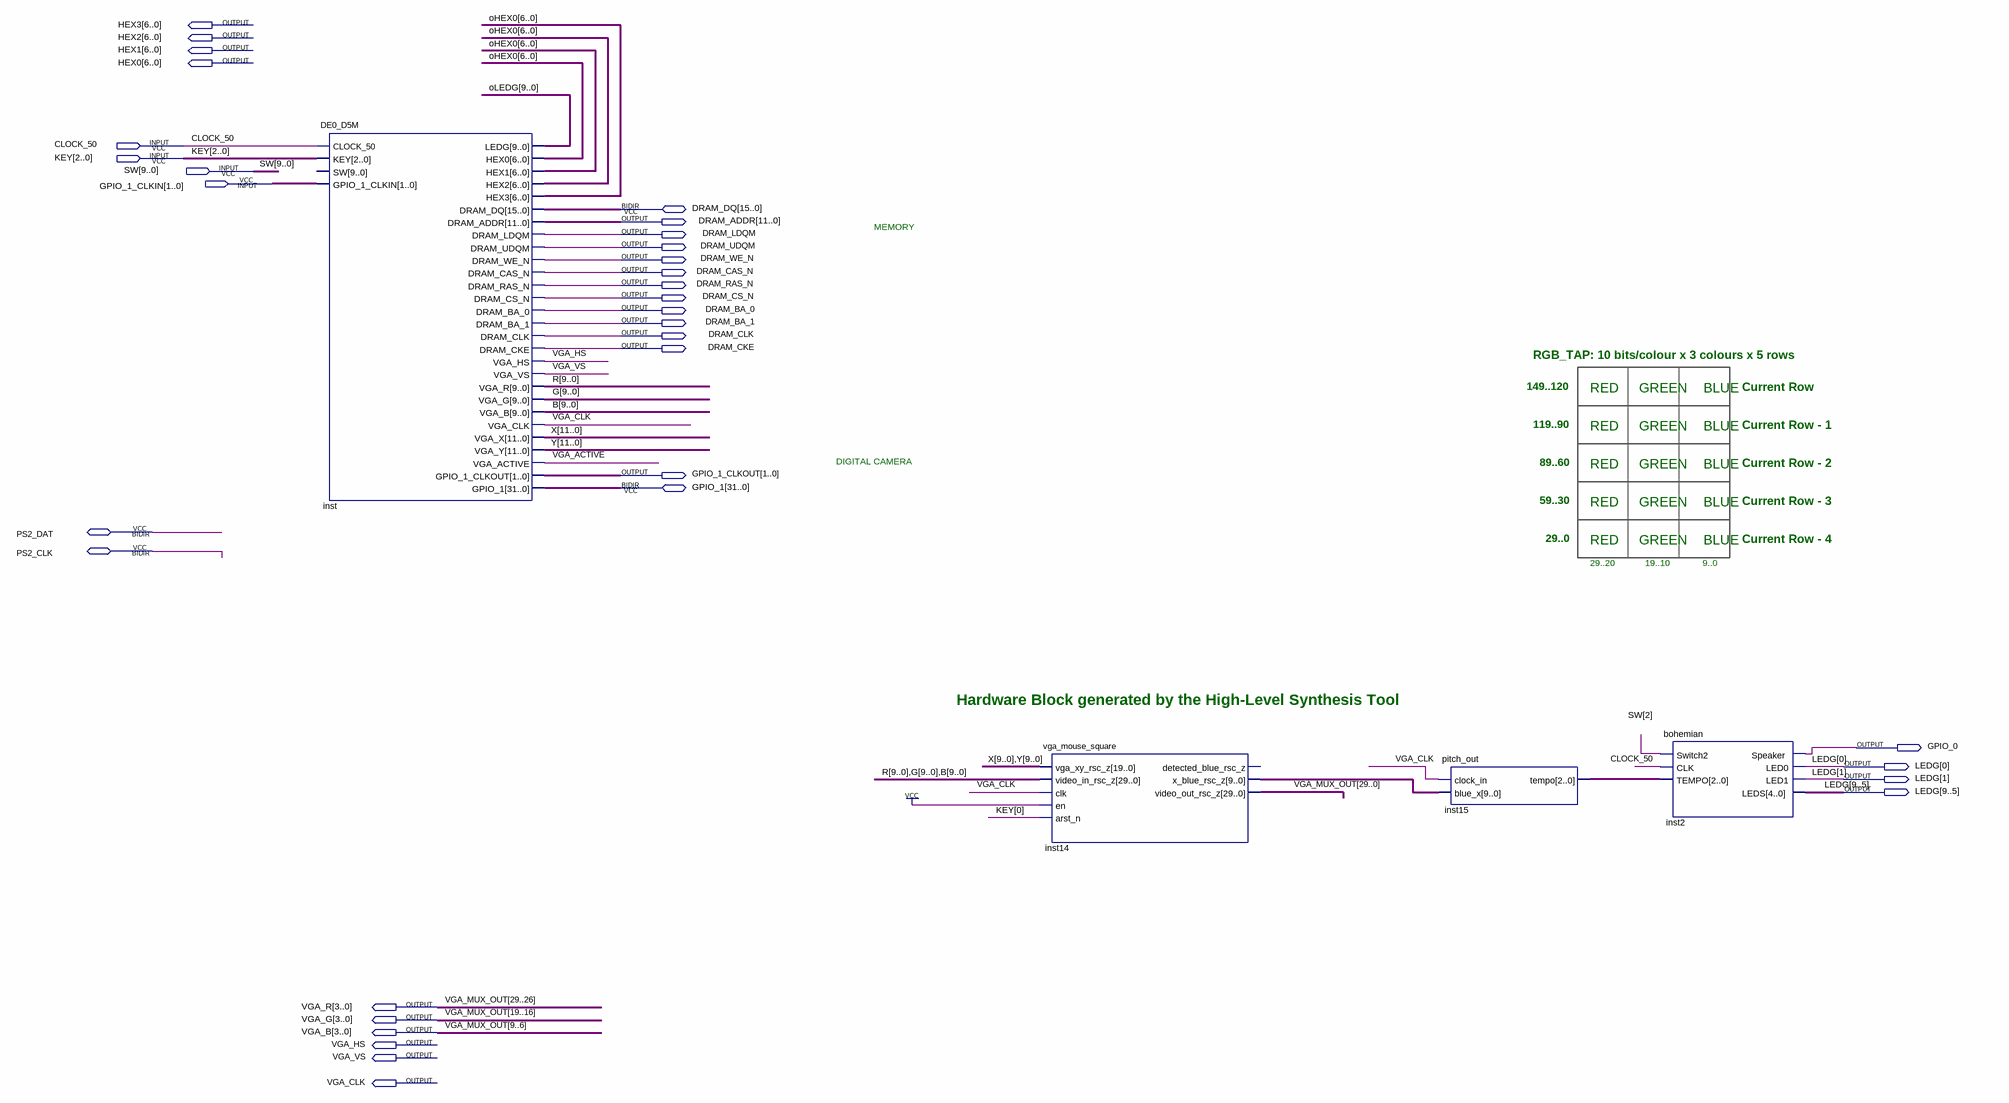
[diagram p0: schematic sheet]
// Quartus schematic TOP_DE0_CAMERA_MOUSE.bdf as structural Verilog: 4 symbols, 34 pins
module TOP_DE0_CAMERA_MOUSE (
  input  CLOCK_50,
  input  [2:0] KEY,
  input  [9:0] SW,
  input  [1:0] GPIO_1_CLKIN,
  inout  [15:0] DRAM_DQ,
  inout  [31:0] GPIO_1,
  inout  PS2_DAT,
  inout  PS2_CLK,
  output [6:0] HEX3,
  output [6:0] HEX2,
  output [6:0] HEX1,
  output [6:0] HEX0,
  output [11:0] DRAM_ADDR,
  output DRAM_LDQM,
  output DRAM_UDQM,
  output DRAM_WE_N,
  output DRAM_CAS_N,
  output DRAM_RAS_N,
  output DRAM_CS_N,
  output DRAM_BA_0,
  output DRAM_BA_1,
  output DRAM_CLK,
  output DRAM_CKE,
  output [1:0] GPIO_1_CLKOUT,
  output GPIO_0,
  output [9:0] LEDG,
  output [3:0] VGA_R,
  output [3:0] VGA_G,
  output [3:0] VGA_B,
  output VGA_HS,
  output VGA_VS,
  output VGA_CLK
);

  wire VGA_ACTIVE;
  wire [2:0] inst15_tempo;
  wire [6:0] oHEX0;
  wire [9:0] B, G, inst14_x_blue_rsc_z, oLEDG, R;
  wire [11:0] X, Y;
  wire [25:0] VGA_MUX_OUT;

  DE0_D5M inst (
    .CLOCK_50(CLOCK_50), .KEY(KEY), .GPIO_1_CLKIN(GPIO_1_CLKIN), .LEDG(oLEDG), .HEX0(oHEX0), .HEX1(oHEX0),
    .HEX2(oHEX0), .HEX3(oHEX0), .DRAM_ADDR(DRAM_ADDR), .DRAM_LDQM(DRAM_LDQM), .DRAM_UDQM(DRAM_UDQM),
    .DRAM_WE_N(DRAM_WE_N), .DRAM_CAS_N(DRAM_CAS_N), .DRAM_RAS_N(DRAM_RAS_N), .DRAM_CS_N(DRAM_CS_N),
    .DRAM_BA_0(DRAM_BA_0), .DRAM_BA_1(DRAM_BA_1), .DRAM_CLK(DRAM_CLK), .DRAM_CKE(DRAM_CKE), .VGA_HS(VGA_HS),
    .VGA_VS(VGA_VS), .VGA_R(R), .VGA_G(G), .VGA_B(B), .VGA_CLK(VGA_CLK), .VGA_X(X), .VGA_Y(Y),
    .VGA_ACTIVE(VGA_ACTIVE), .GPIO_1_CLKOUT(GPIO_1_CLKOUT), .DRAM_DQ(DRAM_DQ), .GPIO_1(GPIO_1));  // open: SW
  vga_mouse_square inst14 (
    .vga_xy_rsc_z({X[9:0], Y[9:0]}), .video_in_rsc_z({R, G, B}), .clk(VGA_CLK), .en(1'b1), .arst_n(KEY[0]),
    .x_blue_rsc_z(inst14_x_blue_rsc_z),
    .video_out_rsc_z({VGA_R, VGA_MUX_OUT[25:20], VGA_G, VGA_MUX_OUT[15:10], VGA_B, VGA_MUX_OUT[5:0]}));  // open: detected_blue_rsc_z
  pitch_out inst15 (.clock_in(VGA_CLK), .blue_x(inst14_x_blue_rsc_z), .tempo(inst15_tempo));
  bohemian inst2 (
    .Switch2(SW[2]), .CLK(CLOCK_50), .TEMPO(inst15_tempo), .Speaker(GPIO_0), .LED0(LEDG[0]), .LED1(LEDG[1]),
    .LEDS(LEDG[9:5]));

  // Other names for the same wires on the sheet: VGA_MUX_OUT (some bits) = {VGA_R, VGA_G, VGA_B}

  // Notes on the sheet:
  //   MEMORY
  //   RGB_TAP: 10 bits/colour x 3 colours x 5 rows
  //   149..120
  //   RED     GREEN    BLUE
  //   Current Row
  //   119..90
  //   RED     GREEN    BLUE
  //   Current Row - 1
  //   DIGITAL CAMERA
  //   89..60
  //   RED     GREEN    BLUE
  //   Current Row - 2
  //   59..30
  //   RED     GREEN    BLUE
  //   Current Row - 3
  //   29..0
  //   RED     GREEN    BLUE
  //   Current Row - 4
  //   29..20            19..10             9..0
  //   Hardware Block generated by the High-Level Synthesis Tool
endmodule
